# Altium schematic sheet Storage.SchDoc
size A3; SheetNumber: 7; SheetTotal: 9
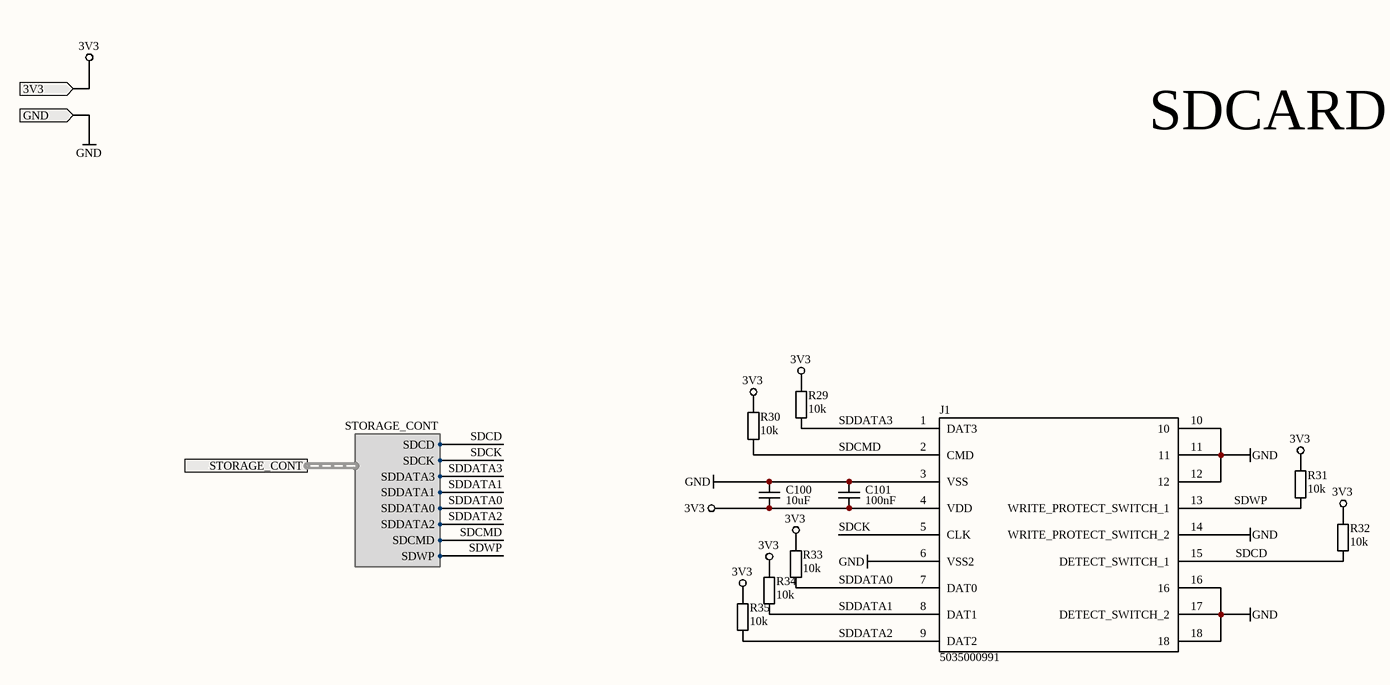
[diagram p0: Storage.SchDoc]

## Parts
C100  10uF  [C_0805]
C101  100nF  [C_0402]
J1  5035000991  [5035000991]
R29  10k  [R_0402]
R30  10k  [R_0402]
R31  10k  [R_0402]
R32  10k  [R_0402]
R33  10k  [R_0402]
R34  10k  [R_0402]
R35  10k  [R_0402]

## Ports
3V3 (in), GND (in), STORAGE_CONT (harness STORAGE_CONT)

## Harnesses
STORAGE_CONT: SDCK, SDCMD, SDDATA0, SDDATA1, SDDATA2, SDDATA3, SDCD, SDWP

## Nets
3V3: C100.2 C101.1 J1.4(VDD) R29.2 R30.2 R31.2 R32.2 R33.2 R34.2 R35.2 ; port 3V3
GND: C100.1 C101.2 J1.3(VSS) J1.6(VSS2) J1.10 J1.11 J1.12 J1.14(WRITE_PROTECT_SWITCH_2) J1.16 J1.17(DETECT_SWITCH_2) J1.18 ; port GND
SDCD: J1.15(DETECT_SWITCH_1) R32.1 ; port STORAGE_CONT.SDCD
SDCK: J1.5(CLK) ; port STORAGE_CONT.SDCK
SDCMD: J1.2(CMD) R30.1 ; port STORAGE_CONT.SDCMD
SDDATA0: J1.7(DAT0) R33.1 ; port STORAGE_CONT.SDDATA0
SDDATA1: J1.8(DAT1) R34.1 ; port STORAGE_CONT.SDDATA1
SDDATA2: J1.9(DAT2) R35.1 ; port STORAGE_CONT.SDDATA2
SDDATA3: J1.1(DAT3) R29.1 ; port STORAGE_CONT.SDDATA3
SDWP: J1.13(WRITE_PROTECT_SWITCH_1) R31.1 ; port STORAGE_CONT.SDWP

## Notes on the sheet
- SDCARD

## Library data of the parts
C100 = GCJ21BR71A106KE01L: 10uF 10V X7R
C101 = C0402C104J8RACAUTO: 100nF 10V 0402 X7R
J1 = 5035000991: SD Card Connector; Manufacturer_Name: Molex; Datasheet Link: https://www.arrow.com/en/products/5035000991/molex; Height: 2.95mm; Manufacturer_Part_Number: 5035000991; Arrow Part Number: 5035000991; Arrow Price/Stock: https://www.arrow.com/en/products/5035000991/molex?region=nac
R29-R35 = SFR01MZPF1002: 10k 1% 62.5mW